# Altium schematic sheet BANK34.SchDoc: XC7A3G-BANK34
size A4; Date: 9 AUG 2026; Engineer: Parsa Malekpour; Revision: 1.0.0; SheetNumber: 5; SheetTotal: 18
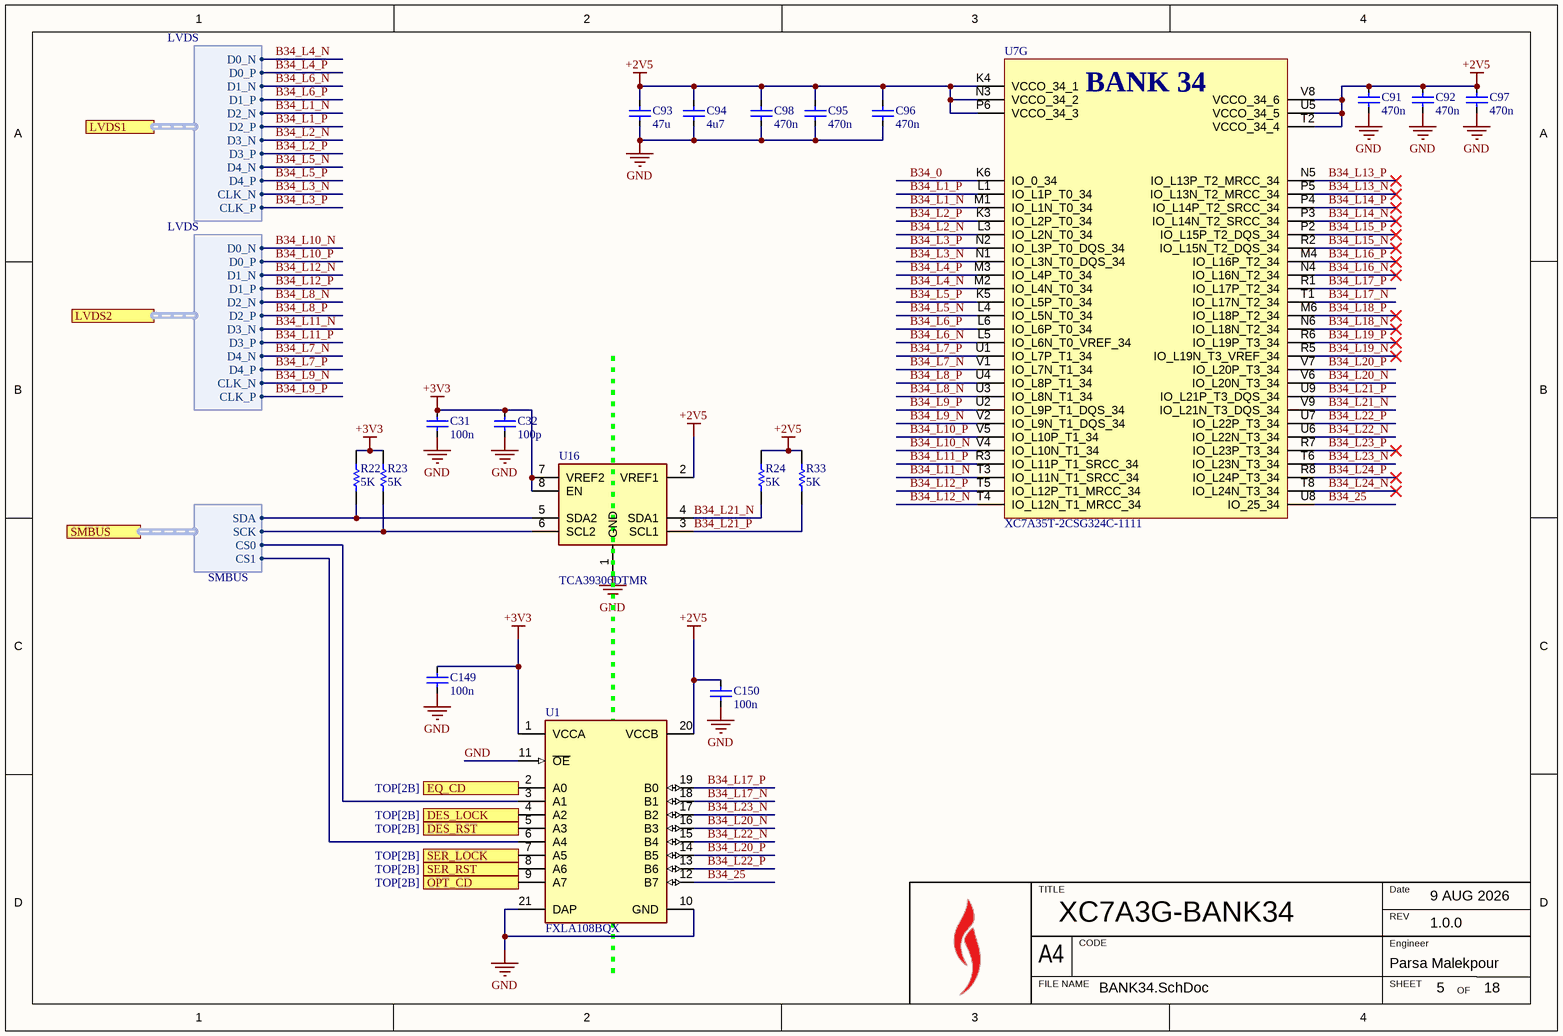
[diagram p0: BANK34.SchDoc]

## Parts
C31  value 100n  [FP-C1005-050-0_05-IPC_C]  (hidden comment: C1005X7R1H104K050BB)
C32  value 100p  [FP-C1005-050-0_05-IPC_C]  (hidden comment: C1005C0G1H101J050BA)
C91  value 470n  [FP-C1005-050-0_05-IPC_C]  (hidden comment: C1005X5R1E474K050BB)
C92  value 470n  [FP-C1005-050-0_05-IPC_C]  (hidden comment: C1005X5R1E474K050BB)
C93  value 47u  [FP-C2012-125-0_2-IPC_C]  (hidden comment: C2012X5R1A476M125AC)
C94  value 4u7  [FP-C1005-050-0_20-0_10-IPC_C]  (hidden comment: C1005X5R1A475K050BE)
C95  value 470n  [FP-C1005-050-0_05-IPC_C]  (hidden comment: C1005X5R1E474K050BB)
C96  value 470n  [FP-C1005-050-0_05-IPC_C]  (hidden comment: C1005X5R1E474K050BB)
C97  value 470n  [FP-C1005-050-0_05-IPC_C]  (hidden comment: C1005X5R1E474K050BB)
C98  value 470n  [FP-C1005-050-0_05-IPC_C]  (hidden comment: C1005X5R1E474K050BB)
C149  value 100n  [FP-C1005-050-0_05-IPC_C]  (hidden comment: C1005X7R1H104K050BB)
C150  value 100n  [FP-C1005-050-0_05-IPC_C]  (hidden comment: C1005X7R1H104K050BB)
R22  value 5K  [RESC1005X40X25LL05T10]  (hidden comment: RC0402FR-075KL)
R23  value 5K  [RESC1005X40X25LL05T10]  (hidden comment: RC0402FR-075KL)
R24  value 5K  [RESC1005X40X25LL05T10]  (hidden comment: RC0402FR-075KL)
R33  value 5K  [RESC1005X40X25LL05T10]  (hidden comment: RC0402FR-075KL)
U1  FXLA108BQX  [FP-510CD-MFG]
U7  XC7A35T-2CSG324C-1111  [BGA324C80P18X18_1500X1500X150]  (part G of 8)
U16  TCA39306DTMR  [TCA39306DTMR]

## Ports
DES_LOCK (in, see TOP[2B]), DES_RST (out, see TOP[2B]), EQ_CD (in, see TOP[2B]), LVDS1 (harness LVDS, see TOP[2C]), LVDS2 (harness LVDS, see TOP[2C]), OPT_CD (in, see TOP[2B]), SER_LOCK (in, see TOP[2B]), SER_RST (out, see TOP[2B]), SMBUS (harness SMBUS, see TOP[2C], DESERILIZER[4A], SERIALIZER[4B])

## Harnesses
LVDS: D0_N, D0_P, D1_N, D1_P, D2_N, D2_P, D3_N, D3_P, D4_N, D4_P, CLK_N, CLK_P
SMBUS: SDA, SCK, CS0, CS1

## Nets
+2V5: C91.1 C92.1 C93.1 C94.1 C95.1 C96.1 C97.1 C98.1 C150.1 R24.1 R33.1 U1.20(VCCB) U7.K4(VCCO_34_1) U7.N3(VCCO_34_2) U7.P6(VCCO_34_3) U7.T2(VCCO_34_4) U7.U5(VCCO_34_5) U7.V8(VCCO_34_6) U16.2(VREF1)
+3V3: C31.1 C32.1 C149.1 R22.1 R23.1 U1.1(VCCA) U16.7(VREF2) U16.8(EN)
GND: C31.2 C32.2 C91.2 C92.2 C93.2 C94.2 C95.2 C96.2 C97.2 C98.2 C149.2 C150.2 U1.10(GND) U1.11(~{OE}) U1.21(DAP) U16.1(GND)
B34_0: U7.K6(IO_0_34)
B34_25: U1.12(B7) U7.U8(IO_25_34)
B34_L1_N: U7.M1(IO_L1N_T0_34) ; port LVDS1.D2_N
B34_L1_P: U7.L1(IO_L1P_T0_34) ; port LVDS1.D2_P
B34_L2_N: U7.L3(IO_L2N_T0_34) ; port LVDS1.D3_N
B34_L2_P: U7.K3(IO_L2P_T0_34) ; port LVDS1.D3_P
B34_L3_N: U7.N1(IO_L3N_T0_DQS_34) ; port LVDS1.CLK_N
B34_L3_P: U7.N2(IO_L3P_T0_DQS_34) ; port LVDS1.CLK_P
B34_L4_N: U7.M2(IO_L4N_T0_34) ; port LVDS1.D0_N
B34_L4_P: U7.M3(IO_L4P_T0_34) ; port LVDS1.D0_P
B34_L5_N: U7.L4(IO_L5N_T0_34) ; port LVDS1.D4_N
B34_L5_P: U7.K5(IO_L5P_T0_34) ; port LVDS1.D4_P
B34_L6_N: U7.L5(IO_L6N_T0_VREF_34) ; port LVDS1.D1_N
B34_L6_P: U7.L6(IO_L6P_T0_34) ; port LVDS1.D1_P
B34_L7_N: U7.V1(IO_L7N_T1_34) ; port LVDS2.D4_N
B34_L7_P: U7.U1(IO_L7P_T1_34) ; port LVDS2.D4_P
B34_L8_N: U7.U3(IO_L8N_T1_34) ; port LVDS2.D2_N
B34_L8_P: U7.U4(IO_L8P_T1_34) ; port LVDS2.D2_P
B34_L9_N: U7.V2(IO_L9N_T1_DQS_34) ; port LVDS2.CLK_N
B34_L9_P: U7.U2(IO_L9P_T1_DQS_34) ; port LVDS2.CLK_P
B34_L10_N: U7.V4(IO_L10N_T1_34) ; port LVDS2.D0_N
B34_L10_P: U7.V5(IO_L10P_T1_34) ; port LVDS2.D0_P
B34_L11_N: U7.T3(IO_L11N_T1_SRCC_34) ; port LVDS2.D3_N
B34_L11_P: U7.R3(IO_L11P_T1_SRCC_34) ; port LVDS2.D3_P
B34_L12_N: U7.T4(IO_L12N_T1_MRCC_34) ; port LVDS2.D1_N
B34_L12_P: U7.T5(IO_L12P_T1_MRCC_34) ; port LVDS2.D1_P
B34_L13_N: U7.P5(IO_L13N_T2_MRCC_34)
B34_L13_P: U7.N5(IO_L13P_T2_MRCC_34)
B34_L14_N: U7.P3(IO_L14N_T2_SRCC_34)
B34_L14_P: U7.P4(IO_L14P_T2_SRCC_34)
B34_L15_N: U7.R2(IO_L15N_T2_DQS_34)
B34_L15_P: U7.P2(IO_L15P_T2_DQS_34)
B34_L16_N: U7.N4(IO_L16N_T2_34)
B34_L16_P: U7.M4(IO_L16P_T2_34)
B34_L17_N: U1.18(B1) U7.T1(IO_L17N_T2_34)
B34_L17_P: U1.19(B0) U7.R1(IO_L17P_T2_34)
B34_L18_N: U7.N6(IO_L18N_T2_34)
B34_L18_P: U7.M6(IO_L18P_T2_34)
B34_L19_N: U7.R5(IO_L19N_T3_VREF_34)
B34_L19_P: U7.R6(IO_L19P_T3_34)
B34_L20_N: U1.16(B3) U7.V6(IO_L20N_T3_34)
B34_L20_P: U1.14(B5) U7.V7(IO_L20P_T3_34)
B34_L21_N: R24.2 U7.V9(IO_L21N_T3_DQS_34) U16.4(SDA1)
B34_L21_P: R33.2 U7.U9(IO_L21P_T3_DQS_34) U16.3(SCL1)
B34_L22_N: U1.15(B4) U7.U6(IO_L22N_T3_34)
B34_L22_P: U1.13(B6) U7.U7(IO_L22P_T3_34)
B34_L23_N: U1.17(B2) U7.T6(IO_L23N_T3_34)
B34_L23_P: U7.R7(IO_L23P_T3_34)
B34_L24_N: U7.T8(IO_L24N_T3_34)
B34_L24_P: U7.R8(IO_L24P_T3_34)
DES_LOCK: U1.4(A2) ; port DES_LOCK
DES_RST: U1.5(A3) ; port DES_RST
EQ_CD: U1.2(A0) ; port EQ_CD
OPT_CD: U1.9(A7) ; port OPT_CD
SER_LOCK: U1.7(A5) ; port SER_LOCK
SER_RST: U1.8(A6) ; port SER_RST
NetR22_2: R22.2 U16.5(SDA2) ; port SMBUS.SDA
NetR23_2: R23.2 U16.6(SCL2) ; port SMBUS.SCK
NetU1_3: U1.3(A1) ; port SMBUS.CS0
NetU1_6: U1.6(A4) ; port SMBUS.CS1

## Notes on the sheet
- TITLE
- REV
- Date
- A4
- FILE NAME
- CODE
- SHEET
- Engineer
- OF
- (in symbol XC7A35T-2CSG324C-1111, part G) BANK 34

## Library data of the parts
C31 C149 C150 = C1005X7R1H104K050BB: MLCC 100nF ±10% 50V X7R SMD 0402; Dielectric Material: Ceramic; Voltage: 50V; Min Operating Temperature: -55°C; Depth: 0.5mm; Radiation Hardening: No; RoHS Compliant: Yes; Voltage Rating (DC): 50V; Lead Free: Lead Free; Resistor Type: Ceramic; Height: 0.5mm; Dielectric: X7R; Thickness: 0.022inch; Case/Package: 0402; Case Code (Metric): 1005; Termination: SMD/SMT; Packaging: Tape and Reel; Max Operating Temperature: 125°C; Mount: Surface Mount; Package Quantity: 1; Width: 0.02inch; Weight: 2.3E-05oz; Voltage Rating: 50V; Tolerance: 10%; Construction: Flat; Case Code (Imperial): 0402; Length: 1mm; REACH SVHC: No SVHC; Series: C; Part Number: C1005X7R1H104K050BB
C32 = C1005C0G1H101J050BA: MLCC 100pF ±5% 50V C0G SMD 0402; Temperature Coefficient: 30ppm/°C; Dielectric Material: Ceramic; Packaging: Tape and Reel; Number of Pins: 2; Construction: Flat; Max Operating Temperature: 125°C; Depth: 0.5mm; Radiation Hardening: No; Length: 1mm; Mount: Surface Mount; Thickness: 0.022inch; RoHS Compliant: Yes; Width: 0.5mm; Termination: SMD/SMT; Min Operating Temperature: -55°C; Case/Package: 0402; Tolerance: 5%; Height: 0.5mm; Dielectric: C0G; REACH SVHC: No SVHC; Case Code (Imperial): 0402; Voltage Rating: 50V; Package Quantity: 1; Voltage Rating (DC): 50V; Weight: 2.3E-05oz; Series: C; Case Code (Metric): 1005; Voltage: 50V; Lead Free: Lead Free; Part Number: C1005C0G1H101J050BA
C91 C92 C95-C98 = C1005X5R1E474K050BB: Multilayer Ceramic Capacitors 470nF ±10% 25V X5R SMD 0402; Dissipation Factor: 10%; Case Code (Metric): 1005; RoHS Compliant: Yes; Lead Free: Lead Free; Length: 1mm; Case/Package: 0402; Termination: SMD/SMT; Dielectric Material: Ceramic; Dielectric: X5R; Depth: 0.5mm; Series: C; Voltage: 25V; Tolerance: 10%; Packaging: Tape and Reel; Resistor Type: Ceramic; Min Operating Temperature: -55°C; Width: 0.02inch; Thickness: 500um; Package Quantity: 10000; Case Code (Imperial): 0402; Construction: Flat; Height: 0.5mm; REACH SVHC: No SVHC; Radiation Hardening: No; Weight: 2.3E-05oz; Mount: Surface Mount; Voltage Rating (DC): 25V; Max Operating Temperature: 85°C; Part Number: C1005X5R1E474K050BB; Voltage Rating: 25V
C93 = C2012X5R1A476M125AC: 47μF ±20% 10V X5R SMD 0805 Multilayer Ceramic Capacitors; RoHS Compliant: Yes; Dielectric: X5R; Case Code (Imperial): 0805; Min Operating Temperature: -55°C; Length: 2mm; Voltage Rating: 10V; Lead Free: Lead Free; Weight: 0.000194oz; Resistor Type: Ceramic; Dielectric Material: Ceramic; Max Operating Temperature: 85°C; Height: 1.25mm; Width: 0.049inch; Depth: 1.25mm; Termination: SMD/SMT; Case/Package: 0805; Voltage Rating (DC): 10V; Voltage: 10V; Thickness: 0.057inch; Tolerance: 20%; REACH SVHC: No SVHC; Package Quantity: 1; Series: C; Case Code (Metric): 2012; Mount: Surface Mount; Packaging: Tape and Reel; Part Number: C2012X5R1A476M125AC
C94 = C1005X5R1A475K050BE: 4.7UF 10V X5R 0402; Tolerance: 10%; Max Operating Temperature: 85°C; Case Code (Metric): 1005; Voltage Rating: 10V; Packaging: Tape and Reel; Case/Package: 0402; Features: Soft Termination; Min Operating Temperature: -55°C; Mount: Surface Mount; Case Code (Imperial): 0402; RoHS Compliant: Yes; Part Number: C1005X5R1A475K050BE
R22-R24 R33 = RC0402FR-075KL: 62.5mW Thick Film Resistors 50V ±100ppm/℃ ±1% 5kΩ 0402 Chip Resistor - Surface Mount ROHS; Manufacturer: Yageo / Phycomp; Manufacturer Part Number: RC0402FR-071KL; Power Rating: 63mW; Temperature Coefficient: 100ppm/°C; Part Number: RC0402FR-075KL; Supplier: Farnell; Supplier Part Number: 2421889; RoHS: Compliant; Category: Chip SMD Resistors; Stock: 6760000; Pricing: 10000=0.464, 50000=0.406, 100000=0.336 (JPY); Case/Package: 0402; Case Code (Imperial): 0402; Case Code (Metric): 0402; China RoHS: Non-Compliant; Composition: Thick Film; Depth: 500µm; Height: 350µm; Lead Free: Lead Free; Length: 1mm; Lifecycle Status: Production; Max Operating Temperature: 155°C; Military Standard: Not; Min Operating Temperature: -55°C; Mounting Technology: Surface Mount; Pins: 2; Number of Terminals: 2; Packaging: Tape & Reel; Power Dissipation: 62.5mW; REACH SVHC: Yes; Schedule B: 8533210045, 8533210045|8533210045|8533210045|8533210045|8533210045|8533210045|8533210045|8533210045|8533210045|8533210045|8533210045|8533210045|8533210045|8533210045|8533210045|8533210045|8533210045|8533210045|8533210045|8533210045|8533210045|8533210045|8533210045|85; Termination: SMD/SMT; Tolerance: 1%; Voltage Rating: 50V; Voltage Rating (AC): 50V; Voltage Rating (DC): 50V; Width: 500µm; Working Voltage: 50V; ComponentLink1URL: https://datasheet.octopart.com:443/RC0402FR-071KL-Yageo-datasheet-175887523.pdf?src-supplier=IHS; ComponentLink1Description: https://datasheet.octopart.com:443/RC0402FR-071KL-Yageo-datasheet-175887523.pdf?src-supplier=IHS; ComponentLink2URL: https://datasheet.octopart.com:443/RC0402FR-071KL-Yageo-datasheet-164759695.pdf?src-supplier=Upverter; ComponentLink2Description: https://datasheet.octopart.com:443/RC0402FR-071KL-Yageo-datasheet-164759695.pdf?src-supplier=Upverter; ComponentLink3URL: https://datasheet.octopart.com:443/RC0402FR-071KL-Yageo-datasheet-103092701.pdf?src-supplier=Upverter; ComponentLink3Description: https://datasheet.octopart.com:443/RC0402FR-071KL-Yageo-datasheet-103092701.pdf?src-supplier=Upverter; ComponentLink4URL: https://sigma.octopart.com:443/138820526/technical_drawing/Yageo-RC0402FR-071KL.pdf?src-supplier=Upverter; ComponentLink4Description: https://sigma.octopart.com:443/138820526/technical_drawing/Yageo-RC0402FR-071KL.pdf?src-supplier=Upverter; ComponentLink5URL: https://datasheet.octopart.com:443/RC0402FR-071KL-Yageo-datasheet-98239111.pdf?src-supplier=Upverter; ComponentLink5Description: https://datasheet.octopart.com:443/RC0402FR-071KL-Yageo-datasheet-98239111.pdf?src-supplier=Upverter; ComponentLink6URL: https://datasheet.octopart.com:443/RC0402FR-071KL-Yageo-Group-datasheet-190305687.pdf?src-supplier=Future+Electronics; ComponentLink6Description: https://datasheet.octopart.com:443/RC0402FR-071KL-Yageo-Group-datasheet-190305687.pdf?src-supplier=Future+Electronics; ComponentLink7URL: https://datasheet.octopart.com:443/RC0402FR-071KL-Yageo-datasheet-12531192.pdf?src-supplier=Future+Electronics; ComponentLink7Description: https://datasheet.octopart.com:443/RC0402FR-071KL-Yageo-datasheet-12531192.pdf?src-supplier=Future+Electronics; ComponentLink8URL: https://datasheet.octopart.com:443/RC0402FR-071KL-Yageo-datasheet-137700087.pdf?src-supplier=Future+Electronics; ComponentLink8Description: https://datasheet.octopart.com:443/RC0402FR-071KL-Yageo-datasheet-137700087.pdf?src-supplier=Future+Electronics; ComponentLink9URL: https://datasheet.octopart.com:443/RC0402FR-071KL-Yageo-datasheet-8324255.pdf?src-supplier=Future+Electronics; ComponentLink9Description: https://datasheet.octopart.com:443/RC0402FR-071KL-Yageo-datasheet-8324255.pdf?src-supplier=Future+Electronics; ComponentLink10URL: https://datasheet.octopart.com:443/RC0402FR-071KL-Yageo-datasheet-10408619.pdf?src-supplier=Newark; ComponentLink10Description: https://datasheet.octopart.com:443/RC0402FR-071KL-Yageo-datasheet-10408619.pdf?src-supplier=Newark; ComponentLink11URL: https://datasheet.octopart.com:443/RC0402FR-071KL-Yageo-datasheet-8324527.pdf?src-supplier=Newark; ComponentLink11Description: https://datasheet.octopart.com:443/RC0402FR-071KL-Yageo-datasheet-8324527.pdf?src-supplier=Newark; ComponentLink12URL: https://datasheet.octopart.com:443/RC0402FR-071KL-Yageo-datasheet-62067350.pdf?src-supplier=Farnell; ComponentLink12Description: https://datasheet.octopart.com:443/RC0402FR-071KL-Yageo-datasheet-62067350.pdf?src-supplier=Farnell; ComponentLink13URL: https://datasheet.octopart.com:443/RC0402FR-071KL-Yageo-datasheet-8329306.pdf?src-supplier=element14; ComponentLink13Description: https://datasheet.octopart.com:443/RC0402FR-071KL-Yageo-datasheet-8329306.pdf?src-supplier=element14; ComponentLink14URL: https://datasheet.octopart.com:443/RC0402FR-071KL-Yageo-datasheet-505231.pdf?src-supplier=element14; ComponentLink14Description: https://datasheet.octopart.com:443/RC0402FR-071KL-Yageo-datasheet-505231.pdf?src-supplier=element14; ComponentLink15URL: https://datasheet.octopart.com:443/RC0402FR-071KL-Yageo-datasheet-175423674.pdf?src-supplier=SOS+electronic; ComponentLink15Description: https://datasheet.octopart.com:443/RC0402FR-071KL-Yageo-datasheet-175423674.pdf?src-supplier=SOS+electronic; ComponentLink16URL: https://datasheet.octopart.com:443/RC0402FR-071KL-Yageo-datasheet-148775077.pdf?src-supplier=TME; ComponentLink16Description: https://datasheet.octopart.com:443/RC0402FR-071KL-Yageo-datasheet-148775077.pdf?src-supplier=TME; ComponentLink17URL: https://datasheet.octopart.com:443/RC0402FR-071KL-Yageo-datasheet-79472498.pdf?src-supplier=Megastar; ComponentLink17Description: https://datasheet.octopart.com:443/RC0402FR-071KL-Yageo-datasheet-79472498.pdf?src-supplier=Megastar; ComponentLink18URL: https://datasheet.octopart.com/RC0402FR-071KL-Yageo-datasheet-73766026.pdf; ComponentLink18Description: https://datasheet.octopart.com/RC0402FR-071KL-Yageo-datasheet-73766026.pdf; ComponentLink19URL: http://sigma.octopart.com:80/conflict_mineral_statement/Yageo-company-3.pdf?src-supplier=Compliance+Statements; ComponentLink19Description: http://sigma.octopart.com:80/conflict_mineral_statement/Yageo-company-3.pdf?src-supplier=Compliance+Statements; ComponentLink20URL: http://sigma.octopart.com:80/rohs_statement/Yageo-company-2.pdf?src-supplier=Compliance+Statements; ComponentLink20Description: http://sigma.octopart.com:80/rohs_statement/Yageo-company-2.pdf?src-supplier=Compliance+Statements; Supplier 1: Farnell; Supplier Part Number 1: 2421889
U1 = FXLA108BQX: IC TRNSLTR BIDIRECTIONAL 20DQFN; Manufacturer: ON Semiconductor; Number Of Outputs: 8; V A Min: 1.1V; Logic Function Desc: Non-Inverting; Propagation Delay: 4ns; Quiescent Current: 10uA; V A Max: 3.6V; Data Rate: 140Mbits/s; Number Of Circuits: 1; Standoff Height: 0mm; Footprint Url: https://www.onsemi.com/pub/Collateral/510CD.PDF; Digikey Description: IC TRNSLTR BIDIRECTIONAL 20DQFN; RoHS: TRUE; ComponentLink2URL: https://www.onsemi.com/pub/Collateral/FXLA108-D.pdf; Mouser Description: Bus Transceivers Dual Supply 8-Bit Voltage Translator; Category: IC; Number Of Inputs: 8; Temperature: -40°C to +85°C; Ambient Temperature Range Low: -40°C; Ambient Temperature Range High: +85°C; Device Class L2: Logic ICs; Device Class L1: Integrated Circuits (ICs); ComponentLink2Description: Datasheet; Height: 0.8mm; Manufacturer Part Number: FXLA108BQX; Octopart: https://octopart.com/fxla108bqx-on+semiconductor-84328716; V B Max: 3.6V; Device Class L3: Voltage Level Shifters; Temperature Range Low: -40°C; Lead Free: Yes; Automotive: No; V B Min: 1.1V; Package: 510CD; Temperature Range High: +85°C
U7 = XC7A35T-2CSG324C-1111: Integrated Circuit; Manufacturer_Name: AMD; Datasheet Link: https://www.xilinx.com/support/documentation/data_sheets/ds181_Artix_7_Data_Sheet.pdf; Height: 1.5mm; Manufacturer_Part_Number: XC7A35T-2CSG324C; Mouser Part Number: 217-XC7A35T-2CSG324C; Mouser Price/Stock: https://www.mouser.co.uk/ProductDetail/AMD-Xilinx/XC7A35T-2CSG324C?qs=rrS6PyfT74fMA9%2F3WtPZmw%3D%3D
U16 = TCA39306DTMR: Integrated Circuit; Manufacturer_Name: Texas Instruments; Datasheet Link: https://www.ti.com/general/docs/suppproductinfo.tsp?distId=26&gotoUrl=https://www.ti.com/lit/gpn/tca39306; Height: 0.4mm; Manufacturer_Part_Number: TCA39306DTMR; Mouser Part Number: 595-TCA39306DTMR; Mouser Price/Stock: https://www.mouser.co.uk/ProductDetail/Texas-Instruments/TCA39306DTMR?qs=A6eO%252BMLsxmTNftHJNMUhEw%3D%3D; Arrow Part Number: TCA39306DTMR; Arrow Price/Stock: https://www.arrow.com/en/products/tca39306dtmr/texas-instruments?utm_currency=USD&region=nac